# EasyEDA schematic SCH_EBike-Controller_2024-08-19.json
TITLE: Sheet_1; REV: 1.0; Date: 2024-08-18; Sheet: 1/1; Drawn By: luisgs231; Company: Your Company
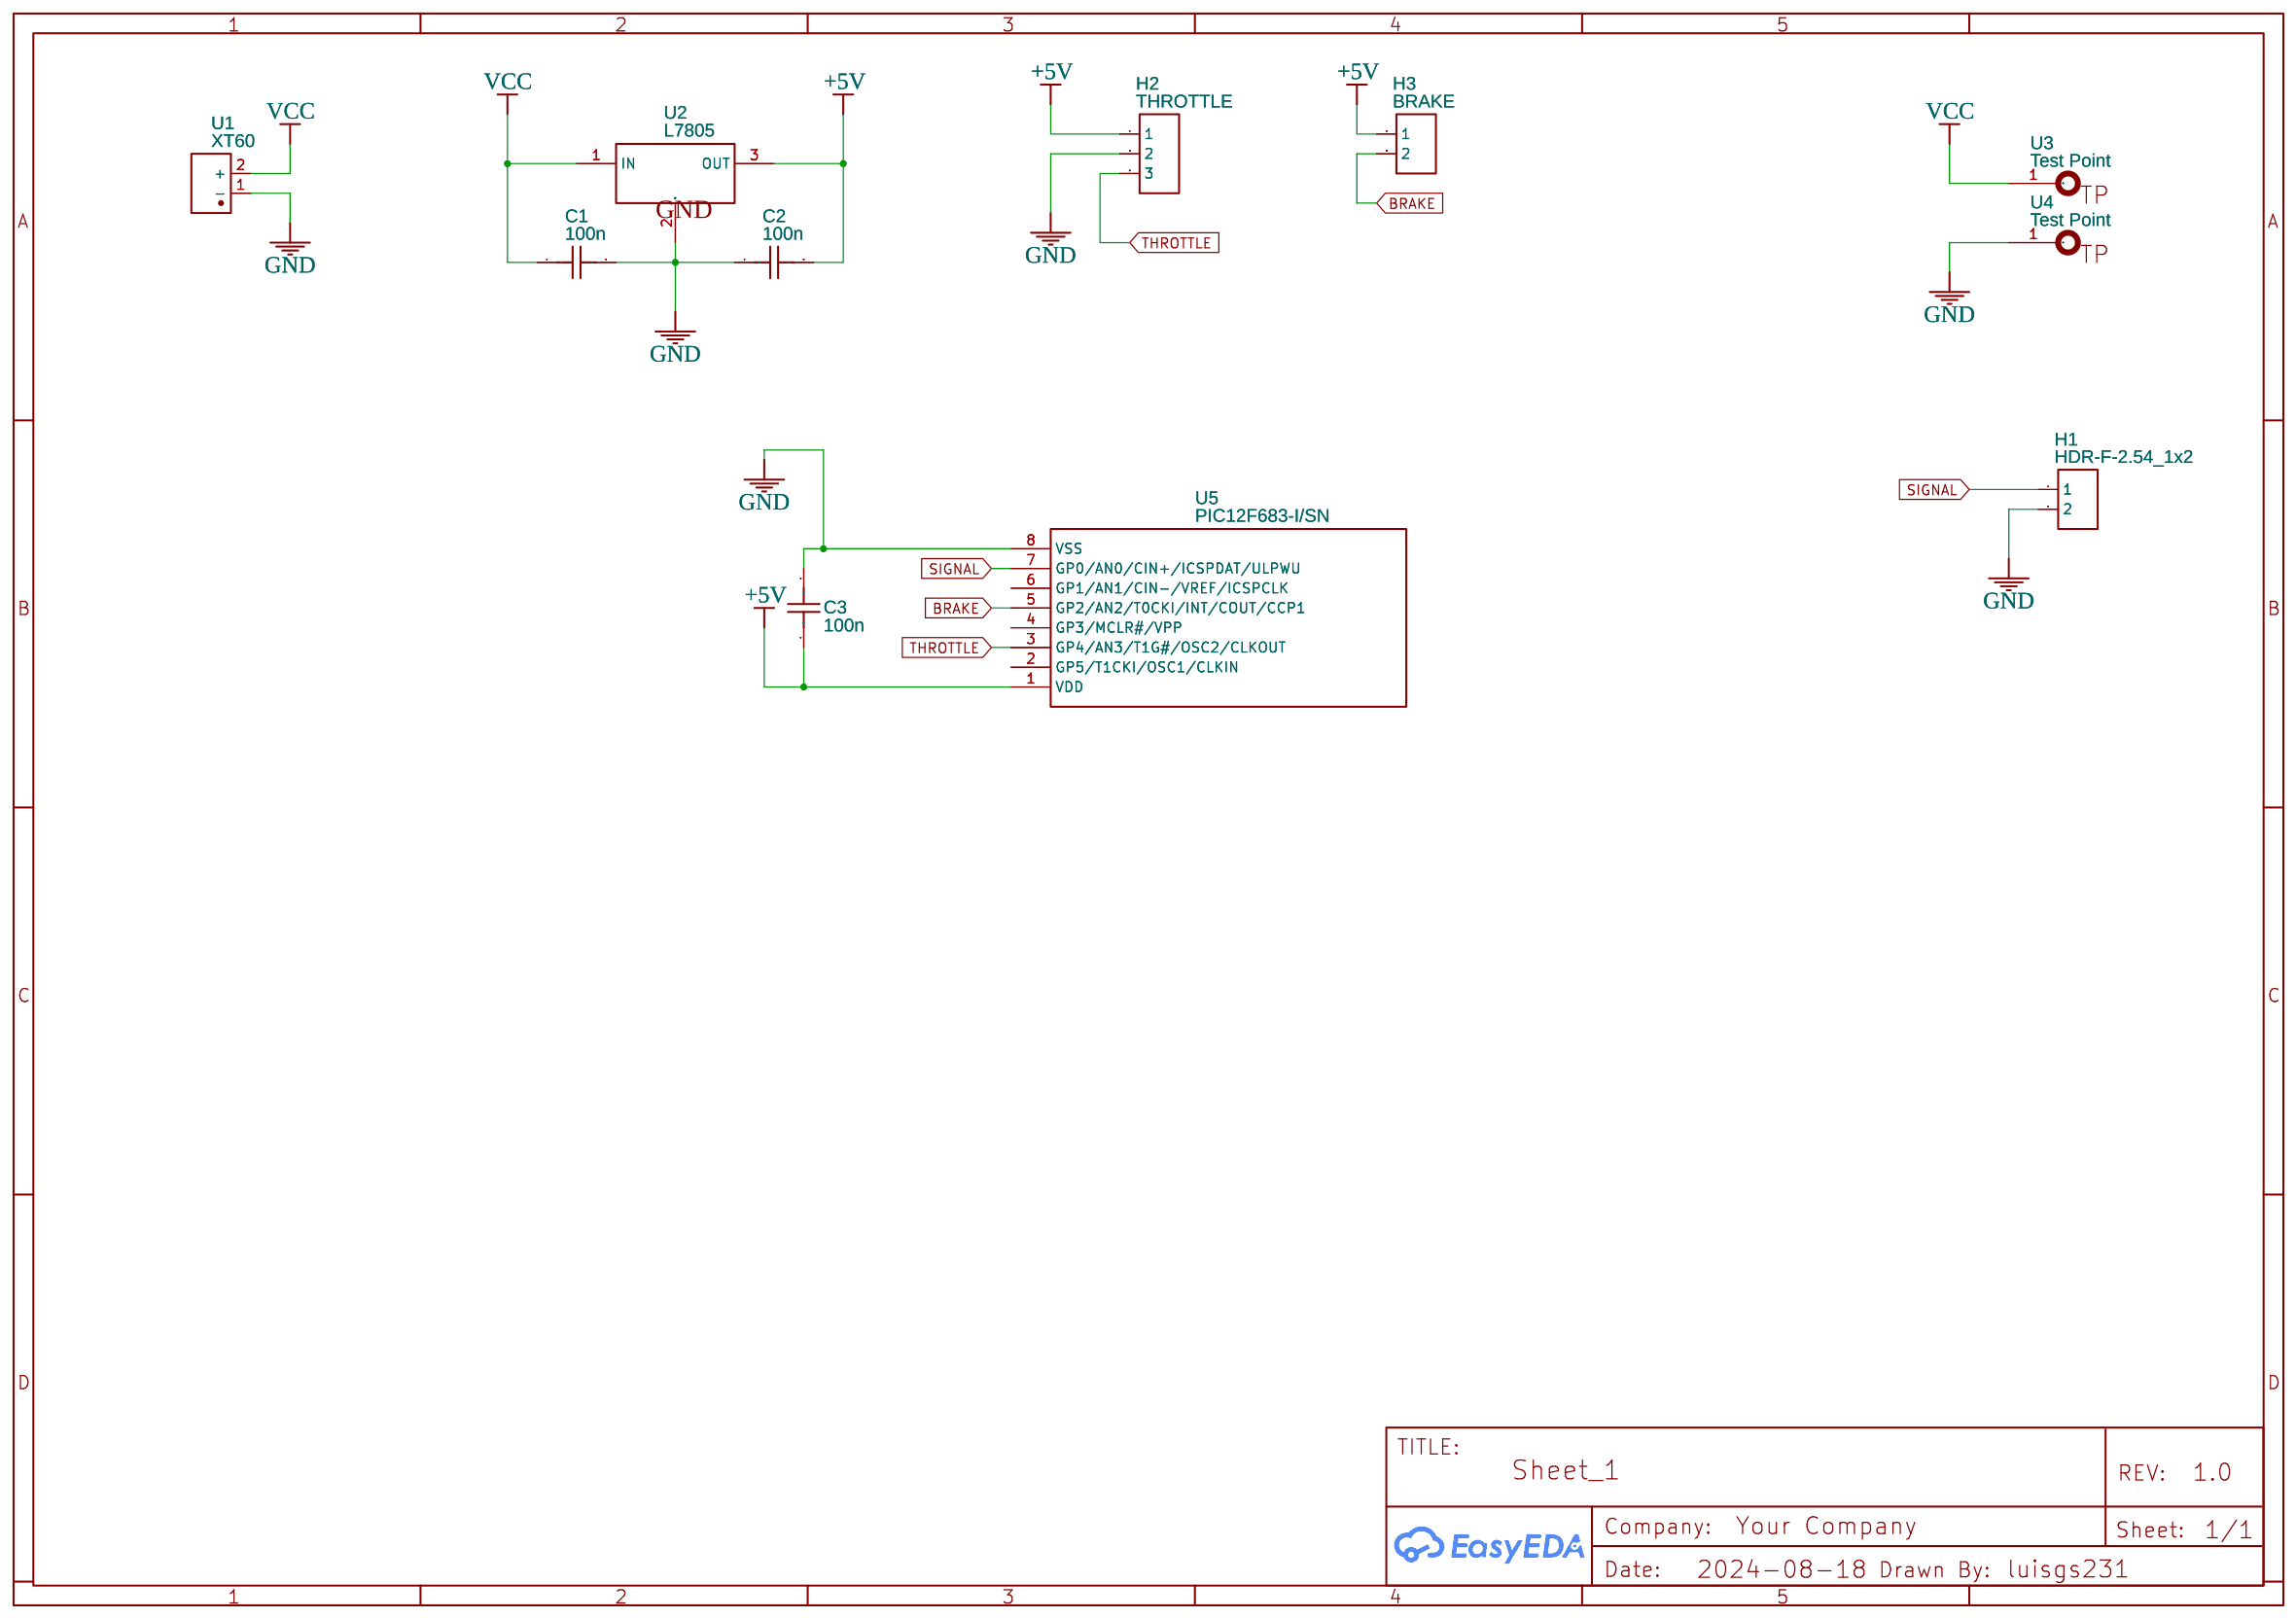
[diagram p0: schematic sheet]

## Parts
C1  100n  [C1206]
C2  100n  [C1206]
C3  100n  [C1206]
H1  HDR-F-2.54_1x2  [HDR-F-2.54_1X2]
H2  THROTTLE  [HDR-F-2.54_1X3]
H3  BRAKE  [HDR-F-2.54_1X2]
U1  XT60  [CONN-TH_XT60]
U2  L7805  [TO-220AB-3_L10.4-W4.6-P2.54-L]
U3  Test Point  [TEST PAD WITH HOLE]
U4  Test Point  [TEST PAD WITH HOLE]
U5  PIC12F683-I/SN  [SOIC-8_L5.0-W4.0-P1.27-LS6.0-BL]

## Library data of the parts
C1-C3 = C_1206_US: Contributor: LCEDA_Lib
H1 H3 = HDR-F-2.54_1x2: Supplier Part: C49661; Supplier: LCSC; Contributor: LCEDA_Lib
H2 = HDR-F-2.54_1x3: Supplier Part: C146690; Supplier: LCSC; Contributor: LCEDA_Lib
U1 = XT60: Contributor: lcsc; Supplier: LCSC; Supplier Part: C98733; Manufacturer: AMASS(艾迈斯); JLCPCB Part Class: Extended Part
U2 = L7805: Contributor: lcsc; Supplier: LCSC; Supplier Part: C7426851; Manufacturer: SY(顺烨）; JLCPCB Part Class: Extended Part
U3 U4 = Test Point: Contributor: nesimmonds
U5 = PIC12F683-I/SN: Contributor: fsergiy; Supplier: microteh; Manufacturer: MICROCHIP; image: //image.lceda.cn/szlcsc/C9729.jpg; Supplier Part: 04879; LCSC Assembly: Yes; SMT Type: Extend

## Nets
+5V: C2.2 C3.2 H2.1 H3.1 U2.3(OUT) U5.1(VDD)
GND: C1.2 C2.1 C3.1 H1.2 H2.2 U1.1(-) U2.2(GND) U4.1(TP) U5.8(VSS)
VCC: C1.1 U1.2(+) U2.1(IN) U3.1(TP)
BRAKE: H3.2 U5.5(GP2/AN2/T0CKI/INT/COUT/CCP1)
SIGNAL: H1.1 U5.7(GP0/AN0/CIN+/ICSPDAT/ULPWU)
THROTTLE: H2.3 U5.3(GP4/AN3/T1G#/OSC2/CLKOUT)

Not connected (* = marked no-connect by the designer): U5 2(GP5/T1CKI/OSC1/CLKIN) 4(GP3/MCLR#/VPP) 6(GP1/AN1/CIN-/VREF/ICSPCLK)
